# EAGLE design TSOC_ESP32S (EAGLE 6.6.0)
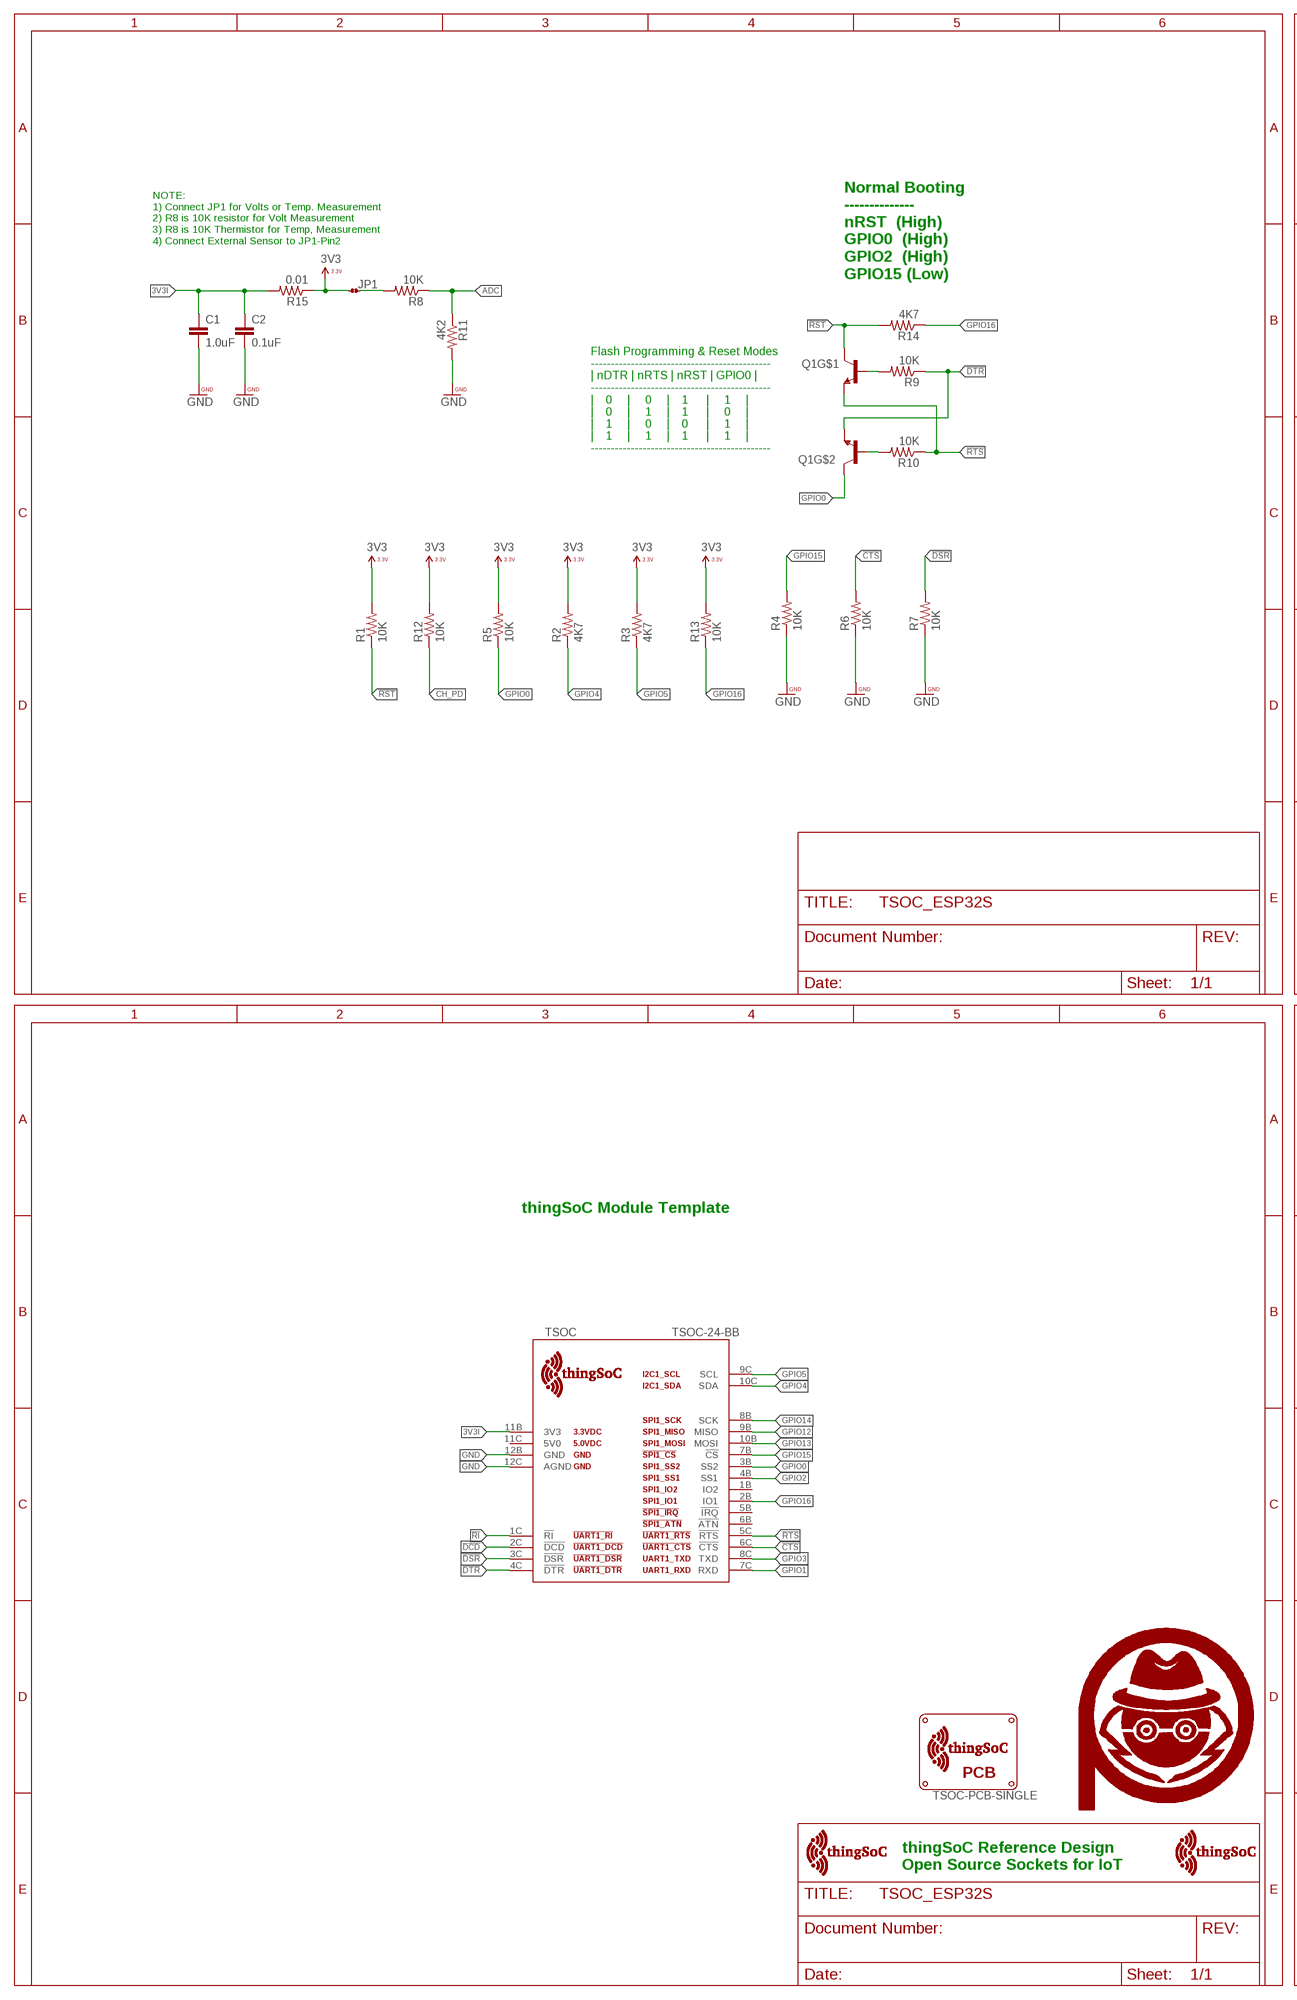
[diagram p0: schematic, sheet 1, part 1 of 2]
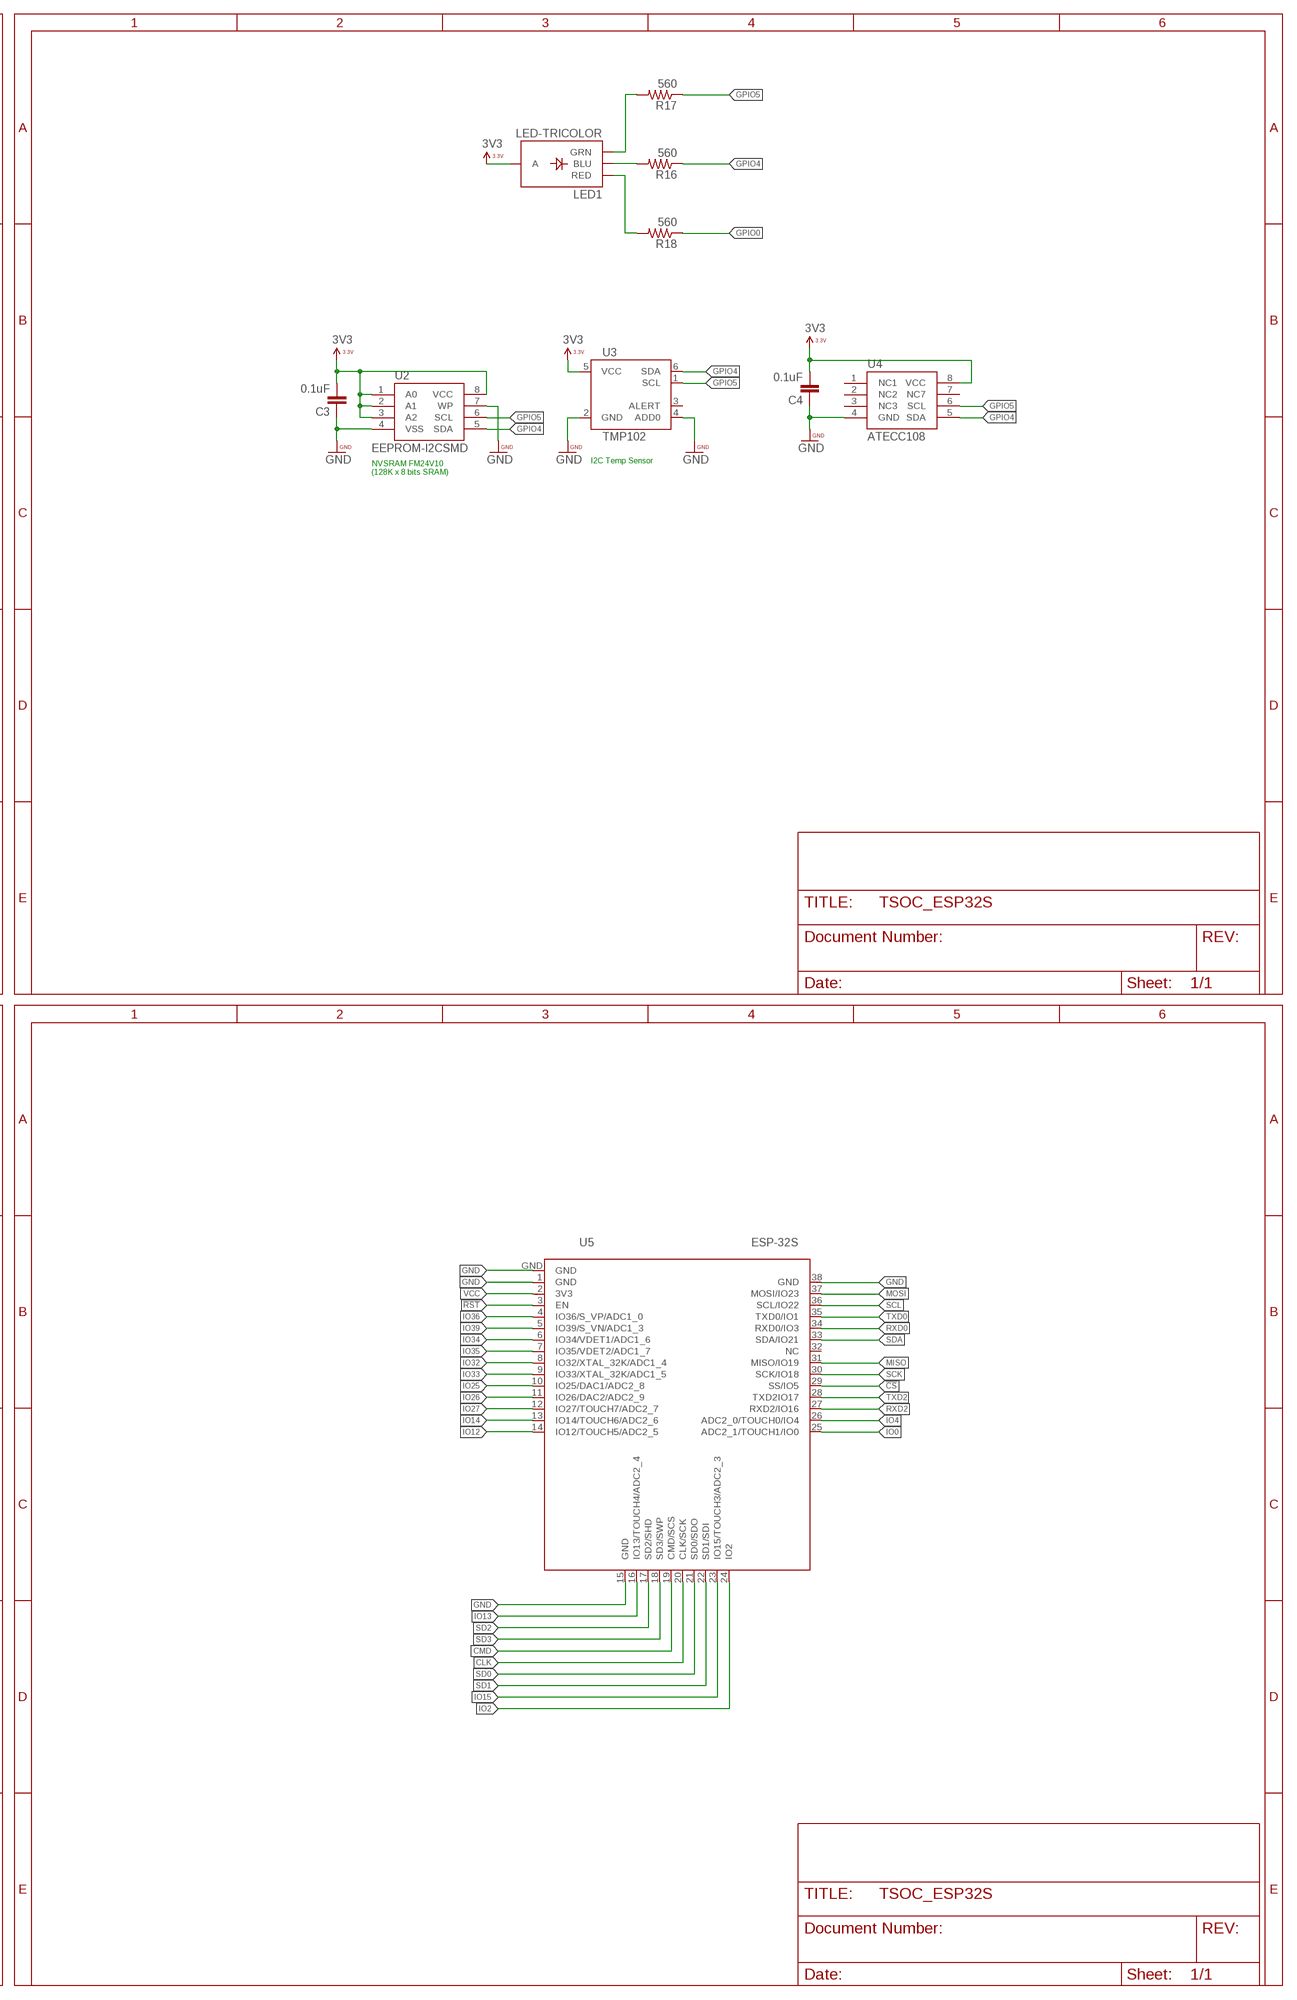
[diagram p1: schematic, sheet 1, part 2 of 2]

## Parts
C1  1.0uF  CAP0402-CAP  [0402-CAP]
C2  0.1uF  CAP0402-CAP  [0402-CAP]
C3  0.1uF  CAP0402-CAP  [0402-CAP]
C4  0.1uF  CAP0402-CAP  [0402-CAP]
JP1  JMP-2-NO-0402  [JMP-2-NO-0402]
LED1  LED-TRICOLOR  [LED-TRICOLOR-SMD]
Q1  MMBT2222A  MMDT3904  [SOT363]
R1  10K  RESISTOR0402  [0402-RES]
R2  4K7  RESISTOR0402  [0402-RES]
R3  4K7  RESISTOR0402  [0402-RES]
R4  10K  RESISTOR0402  [0402-RES]
R5  10K  RESISTOR0402  [0402-RES]
R6  10K  RESISTOR0402  [0402-RES]
R7  10K  RESISTOR0402  [0402-RES]
R8  10K  RESISTOR0402  [0402-RES]
R9  10K  RESISTOR0402  [0402-RES]
R10  10K  RESISTOR0402  [0402-RES]
R11  4K2  RESISTOR0402  [0402-RES]
R12  10K  RESISTOR0402  [0402-RES]
R13  10K  RESISTOR0402  [0402-RES]
R14  4K7  RESISTOR0402  [0402-RES]
R15  0.01  RESISTOR0402  [0402-RES]
R16  560  RESISTOR0402  [0402-RES]
R17  560  RESISTOR0402  [0402-RES]
R18  560  RESISTOR0402  [0402-RES]
TSOC  TSOC-24-BB  [TSOC-BB-S24]
U2  EEPROM-I2CSMD  [SO08]
U3  TMP102  [SOT563]
U4  ATECC108  [SOIC8]
U5  ESP-32S  [ESP-32S]
U$11  PA_LOGO_SYMMED  [PA_LOGO_AGENT_MED_SYM]
U$19  TSOC-LOGO-MED  [TSOC-LOGO-MED]
U$20  TSOC-LOGO-MED  [TSOC-LOGO-MED]
U$25  TSOC-PCB-SINGLE  [TSOC-BB-BRD-DIM]

## Nets
3V3: C3.2 C4.2 JP1.1 LED1.A R1.2 R2.2 R3.2 R5.2 R12.2 R13.2 R15.1 U2.1(A0) U2.2(A1) U2.3(A2) U2.8(VCC) U3.5(VCC) U4.8(VCC)
3V3I: C1.1 C2.1 R15.2 TSOC.11B(3V3)
!CS: U5.29(SS/IO5)
!CTS: R6.2 TSOC.6C(!CTS)
!DCD: TSOC.2C(!DCD)
!DSR: R7.2 TSOC.3C(!DSR)
!DTR: Q1.1(E) R9.1 TSOC.4C(!DTR)
!RI: TSOC.1C(!RI)
!RST: Q1.3(C) R1.1 R14.2 U5.3(EN)
!RTS: Q1.4(E) R10.1 TSOC.5C(!RTS)
ADC: R8.1 R11.1
ADC_RAW: JP1.2 R8.2
BLU: LED1.B(BLU) R16.2
CH_PD: R12.1
CLK: U5.20(CLK/SCK)
CMD: U5.19(CMD/SCS)
GND: C1.2 C2.2 C3.1 C4.1 R4.1 R6.1 R7.1 R11.2 TSOC.12B(GND) TSOC.12C(AGND) U2.4(VSS) U2.7(WP) U3.2(GND) U3.4(ADD0) U4.4(GND) U5.1(GND) U5.15(GND) U5.38(GND) U5.GND
GPIO0: Q1.6(C) R5.1 R18.1 TSOC.3B(SS2)
GPIO1: TSOC.7C(RXD)
GPIO2: TSOC.4B(SS1)
GPIO3: TSOC.8C(TXD)
GPIO4: R2.1 R16.1 TSOC.10C(SDA) U2.5(SDA) U3.6(SDA) U4.5(SDA)
GPIO5: R3.1 R17.1 TSOC.9C(SCL) U2.6(SCL) U3.1(SCL) U4.6(SCL)
GPIO12: TSOC.9B(MISO)
GPIO13: TSOC.10B(MOSI)
GPIO14: TSOC.8B(SCK)
GPIO15: R4.2 TSOC.7B(!CS)
GPIO16: R13.1 R14.1 TSOC.2B(IO1)
GRN: LED1.G(GRN) R17.2
IO0: U5.25(ADC2_1/TOUCH1/IO0)
IO2: U5.24(IO2)
IO4: U5.26(ADC2_0/TOUCH0/IO4)
IO12: U5.14(IO12/TOUCH5/ADC2_5)
IO13: U5.16(IO13/TOUCH4/ADC2_4)
IO14: U5.13(IO14/TOUCH6/ADC2_6)
IO15: U5.23(IO15/TOUCH3/ADC2_3)
IO25: U5.10(IO25/DAC1/ADC2_8)
IO26: U5.11(IO26/DAC2/ADC2_9)
IO27: U5.12(IO27/TOUCH7/ADC2_7)
IO32: U5.8(IO32/XTAL_32K/ADC1_4)
IO33: U5.9(IO33/XTAL_32K/ADC1_5)
IO34: U5.6(IO34/VDET1/ADC1_6)
IO35: U5.7(IO35/VDET2/ADC1_7)
IO36: U5.4(IO36/S_VP/ADC1_0)
IO39: U5.5(IO39/S_VN/ADC1_3)
MISO: U5.31(MISO/IO19)
MOSI: U5.37(MOSI/IO23)
N$6: Q1.5(B) R9.2
N$12: Q1.2(B) R10.2
RED: LED1.R(RED) R18.2
RXD0: U5.34(RXD0/IO3)
RXD2: U5.27(RXD2/IO16)
SCK: U5.30(SCK/IO18)
SCL: U5.36(SCL/IO22)
SD0: U5.21(SD0/SDO)
SD1: U5.22(SD1/SDI)
SD2: U5.17(SD2/SHD)
SD3: U5.18(SD3/SWP)
SDA: U5.33(SDA/IO21)
TXD0: U5.35(TXD0/IO1)
TXD2: U5.28(TXD2IO17)
VCC: U5.2(3V3)
Unconnected: TSOC.1B(IO2) TSOC.5B(!IRQ) TSOC.6B(!ATN) TSOC.11C(5V0) U3.3(ALERT) U4.1(NC1) U4.2(NC2) U4.3(NC3) U4.7(NC7) U5.32(NC)

## Notes on the sheet
- NOTE:
  1) Connect JP1 for Volts or Temp. Measurement
  2) R8 is 10K resistor for Volt Measurement
  3) R8 is 10K Thermistor for Temp, Measurement
  4) Connect External Sensor to JP1-Pin2
- Normal Booting
  --------------
  nRST  (High)
  GPIO0  (High)
  GPIO2  (High) 
  GPIO15 (Low)
- Flash Programming & Reset Modes
  ---------------------------------------------
  | nDTR | nRTS | nRST | GPIO0 |
  ---------------------------------------------
  |    0     |     0     |    1      |     1     |
  |    0     |     1     |    1      |     0     |
  |    1     |     0     |    0      |     1     |
  |    1     |     1     |    1      |     1     |
  ---------------------------------------------
- I2C Temp Sensor
- NVSRAM FM24V10
  (128K x 8 bits SRAM)
- thingSoC Module Template
- thingSoC Reference Design
  Open Source Sockets for IoT

## Library data of the parts
C1-C4 = PatternAgents-ProtoPads:CAP: Capacitor Standard 0603 ceramic capacitor, and 0.1" leaded capacitor.
JP1 = PatternAgents-ProtoPads:JMP-2-NO: Two Terminal Jumper - Normally Open Positions 1 and 2 are normally NOT connected. PatternAgents ProtoPads Library Schematic and PCB layout libraries for design patterns by PatternAgents. For the CADSoft Eagle CAD program : http://www.cadsoftusa.com/download-eagle/ Source LBR : http://www.patternagents.com Github : https://github.com/PatternAgents License : http://creativecommons.org/licenses/by-sa/4.0/ (Creative Commons 4.0) THIS SOFTWARE IS PROVIDED BY THE CONTRIBUTORS "AS IS" AND WITHOUT ANY EXPRESS OR IMPLIED WARRANTIES, INCLUDING, BUT NOT LIMITED TO, THE IMPLIED WARRANTIES OF MERCHANTABILITY AND FITNESS FOR A PARTICULAR PURPOSE ARE DISCLAIMED. IN NO EVENT SHALL THE COPYRIGHT OWNER OR CONTRIBUTORS BE LIABLE FOR ANY DIRECT, INDIRECT, INCIDENTAL, SPECIAL, EXEMPLARY, OR CONSEQUENTIAL DAMAGES (INCLUDING, BUT NOT LIMITED TO, PROCUREMENT OF SUBSTITUTE GOODS OR SERVICES; LOSS OF USE, DATA, OR PROFITS; OR BUSINESS INTERRUPTION) HOWEVER CAUSED AND ON ANY THEORY OF LIABILITY, WHETHER IN CONTRACT, STRICT LIABILITY, OR TORT (INCLUDING NEGLIGENCE OR OTHERWISE) ARISING IN ANY WAY OUT OF THE USE OF THIS SOFTWARE, EVEN IF ADVISED OF THE POSSIBILITY OF SUCH DAMAGE.; BOM: EXCLUDE
LED1 = SparkFun-LED:LED-TRICOLOR: Tri-Color LED SMD Proven layout and schematic for triple color LED in SMD package - common anode. Spark Fun Electronics SKU : COM-07844
Q1 = SparkFun-DiscreteSemi:MMDT3904: Dual NPN transistor
R1-R18 = PatternAgents-ProtoPads:RESISTOR: Resistor Basic schematic elements and footprints for 0603, 1206, and PTH resistors.
TSOC = thingSoC:TSOC-24: thingSoC Twenty-Four(24) Pin Socket Source LBR : http://www.thingsoc.com Github : https://github.com/thingsoc License : http://creativecommons.org/licenses/by-sa/4.0/ (Creative Commons 4.0) THIS SOFTWARE IS PROVIDED BY THE CONTRIBUTORS "AS IS" AND WITHOUT ANY EXPRESS OR IMPLIED WARRANTIES, INCLUDING, BUT NOT LIMITED TO, THE IMPLIED WARRANTIES OF MERCHANTABILITY AND FITNESS FOR A PARTICULAR PURPOSE ARE DISCLAIMED. IN NO EVENT SHALL THE COPYRIGHT OWNER OR CONTRIBUTORS BE LIABLE FOR ANY DIRECT, INDIRECT, INCIDENTAL, SPECIAL, EXEMPLARY, OR CONSEQUENTIAL DAMAGES (INCLUDING, BUT NOT LIMITED TO, PROCUREMENT OF SUBSTITUTE GOODS OR SERVICES; LOSS OF USE, DATA, OR PROFITS; OR BUSINESS INTERRUPTION) HOWEVER CAUSED AND ON ANY THEORY OF LIABILITY, WHETHER IN CONTRACT, STRICT LIABILITY, OR TORT (INCLUDING NEGLIGENCE OR OTHERWISE) ARISING IN ANY WAY OUT OF THE USE OF THIS SOFTWARE, EVEN IF ADVISED OF THE POSSIBILITY OF SUCH DAMAGE.
U2 = SparkFun-DigitalIC:EEPROM-I2C: I2C EEPROM chips, 24LC256 (and others)
U3 = SparkFun-Sensors:TMP102: I2C degC temp sensor; PROD_ID: IC-09303
U4 = SparkFun-DigitalIC:ATECC108: ATECC108: Provides ECDSA with NIST curves P256, B283, and K283. Also, a RNG, 8.5Kb EEPROM. 2.0V - 5.5V.; PROD_ID: IC-11982
U5 = PatternAgents_RFmodules:ESP-32S
U$11 = PatternAgents-Logos:PA_LOGO_SYM: PatternAgents Logo Symbol Trademark : PatternAgents, LLC Github : https://github.com/PatternAgents/PCB_Libraries License : http://creativecommons.org/licenses/by-sa/3.0/ (Creative Commons 3.0) THIS SOFTWARE IS PROVIDED BY THE CONTRIBUTORS "AS IS" AND WITHOUT ANY EXPRESS OR IMPLIED WARRANTIES, INCLUDING, BUT NOT LIMITED TO, THE IMPLIED WARRANTIES OF MERCHANTABILITY AND FITNESS FOR A PARTICULAR PURPOSE ARE DISCLAIMED. IN NO EVENT SHALL THE COPYRIGHT OWNER OR CONTRIBUTORS BE LIABLE FOR ANY DIRECT, INDIRECT, INCIDENTAL, SPECIAL, EXEMPLARY, OR CONSEQUENTIAL DAMAGES (INCLUDING, BUT NOT LIMITED TO, PROCUREMENT OF SUBSTITUTE GOODS OR SERVICES; LOSS OF USE, DATA, OR PROFITS; OR BUSINESS INTERRUPTION) HOWEVER CAUSED AND ON ANY THEORY OF LIABILITY, WHETHER IN CONTRACT, STRICT LIABILITY, OR TORT (INCLUDING NEGLIGENCE OR OTHERWISE) ARISING IN ANY WAY OUT OF THE USE OF THIS SOFTWARE, EVEN IF ADVISED OF THE POSSIBILITY OF SUCH DAMAGE.
U$19 U$20 = thingSoC:TSOC-LOGO: thingSoC Logo Source LBR : http://www.thingsoc.com Github : https://github.com/thingsoc License : http://creativecommons.org/licenses/by-sa/4.0/ (Creative Commons 4.0) THIS SOFTWARE IS PROVIDED BY THE CONTRIBUTORS "AS IS" AND WITHOUT ANY EXPRESS OR IMPLIED WARRANTIES, INCLUDING, BUT NOT LIMITED TO, THE IMPLIED WARRANTIES OF MERCHANTABILITY AND FITNESS FOR A PARTICULAR PURPOSE ARE DISCLAIMED. IN NO EVENT SHALL THE COPYRIGHT OWNER OR CONTRIBUTORS BE LIABLE FOR ANY DIRECT, INDIRECT, INCIDENTAL, SPECIAL, EXEMPLARY, OR CONSEQUENTIAL DAMAGES (INCLUDING, BUT NOT LIMITED TO, PROCUREMENT OF SUBSTITUTE GOODS OR SERVICES; LOSS OF USE, DATA, OR PROFITS; OR BUSINESS INTERRUPTION) HOWEVER CAUSED AND ON ANY THEORY OF LIABILITY, WHETHER IN CONTRACT, STRICT LIABILITY, OR TORT (INCLUDING NEGLIGENCE OR OTHERWISE) ARISING IN ANY WAY OUT OF THE USE OF THIS SOFTWARE, EVEN IF ADVISED OF THE POSSIBILITY OF SUCH DAMAGE.
U$25 = thingSoC:TSOC-PCB: thingSoC PCB Outlines Boards Outlines for Standard Sizes (in the DImension Layer) (Registration marks in the tDocu layer - make sure to turn on tDocu/bDocu) Source LBR : http://www.thingsoc.com Github : https://github.com/thingsoc License : http://creativecommons.org/licenses/by-sa/4.0/ (Creative Commons 4.0) THIS SOFTWARE IS PROVIDED BY THE CONTRIBUTORS "AS IS" AND WITHOUT ANY EXPRESS OR IMPLIED WARRANTIES, INCLUDING, BUT NOT LIMITED TO, THE IMPLIED WARRANTIES OF MERCHANTABILITY AND FITNESS FOR A PARTICULAR PURPOSE ARE DISCLAIMED. IN NO EVENT SHALL THE COPYRIGHT OWNER OR CONTRIBUTORS BE LIABLE FOR ANY DIRECT, INDIRECT, INCIDENTAL, SPECIAL, EXEMPLARY, OR CONSEQUENTIAL DAMAGES (INCLUDING, BUT NOT LIMITED TO, PROCUREMENT OF SUBSTITUTE GOODS OR SERVICES; LOSS OF USE, DATA, OR PROFITS; OR BUSINESS INTERRUPTION) HOWEVER CAUSED AND ON ANY THEORY OF LIABILITY, WHETHER IN CONTRACT, STRICT LIABILITY, OR TORT (INCLUDING NEGLIGENCE OR OTHERWISE) ARISING IN ANY WAY OUT OF THE USE OF THIS SOFTWARE, EVEN IF ADVISED OF THE POSSIBILITY OF SUCH DAMAGE.

## Board
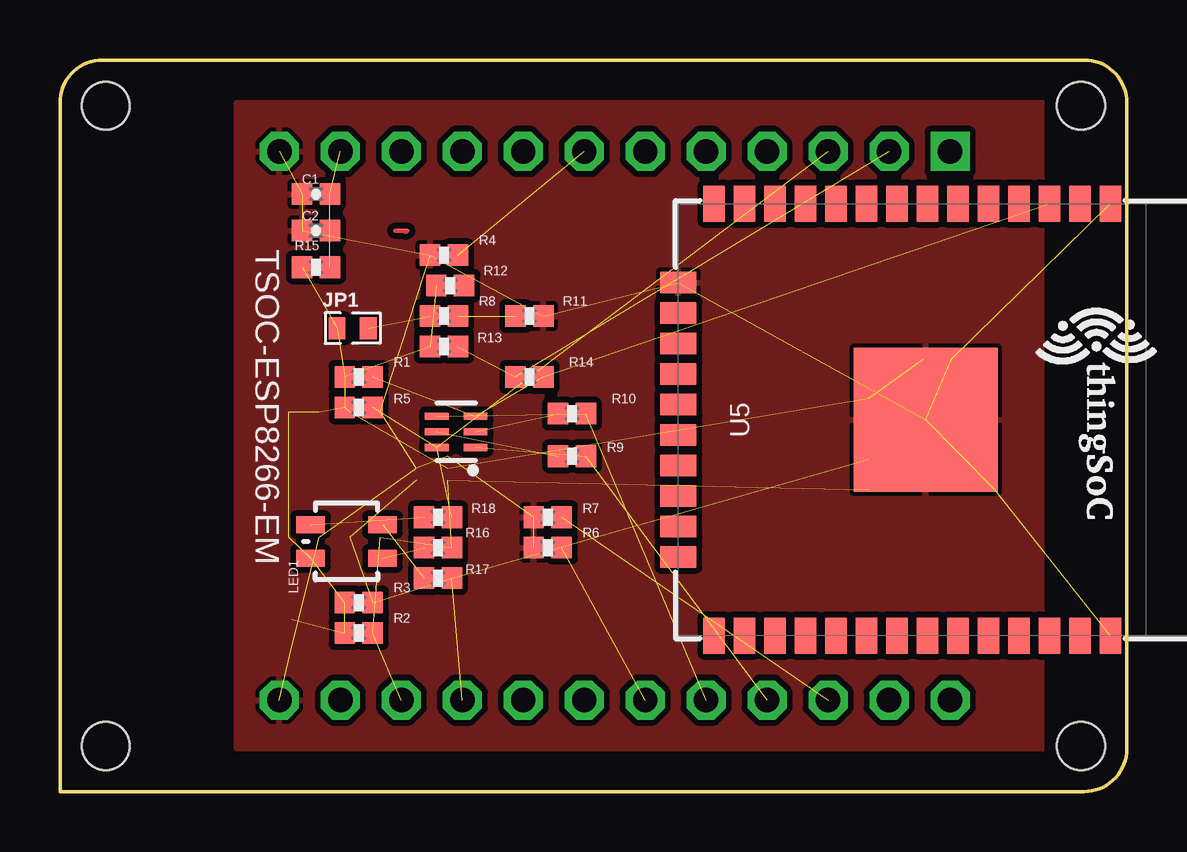
[diagram p2: board, top side]
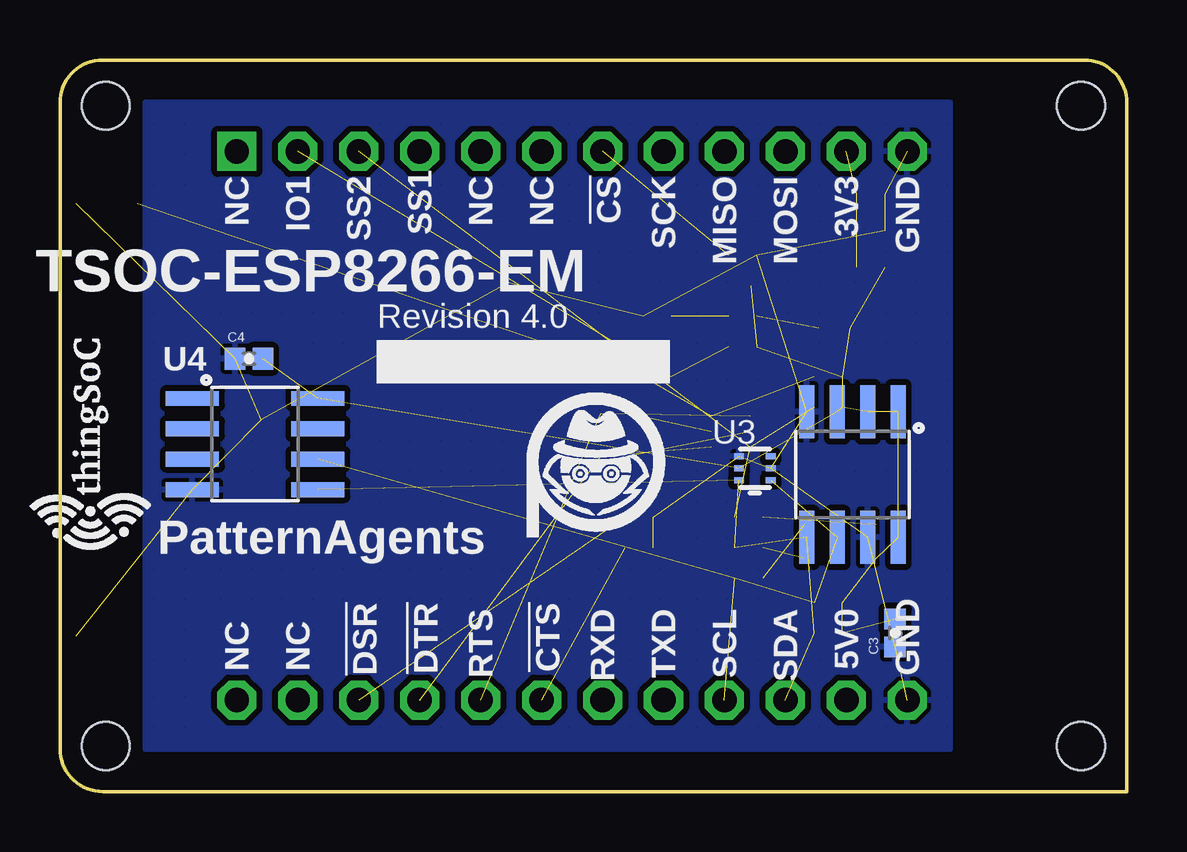
[diagram p3: board, bottom side, seen from below]

Size 44.45 x 30.48 mm. Coordinates in mm from the lower left corner, seen from the top.
Copper layers (1*16): Top 0.035mm / dielectric 1.5mm / Bottom 0.035mm
Design rules "PatternAgents_7mil": minimum track width 7mil, minimum drill 14mil, track to track 7mil, track to pad 7mil, pad to pad 7mil, via to via 7mil, smd to smd 7mil, copper to edge 7mil, drill to drill 7mil, minimum pad ring 12mil, minimum via ring 10mil, stop-mask expansion 4mil, vias tented up to drill 25mil, thermal gap 7mil

### Footprints (pad centres in the part's own frame; a part is rotated, then mirrored left to right if it is on the bottom)
0402-CAP = smd 0.85 x 0.9: 1 -0.58,0; 2 0.58,0
JMP-2-NO-0402 = smd 0.7 x 0.9: 1 -0.65,0; 2 0.65,0
LED-TRICOLOR-SMD = smd 0.7 x 1.2: A 0.7,-1.5; B 0.7,1.5; G -0.7,1.5; R -0.7,-1.5
SOT363 = smd 0.3 x 0.99: 1 -0.65,-0.8; 2 0,-0.8; 3 0.65,-0.8; 4 0.65,0.81; 5 0,0.81; 6 -0.65,0.81
0402-RES = smd 0.85 x 0.9: 1 -0.58,0; 2 0.58,0
TSOC-BB-S24 = drill 1.016 square: 1B -11.43,11.43 | drill 1.016 octagon: 1C 11.43,11.43; 2B -11.43,8.89; 2C 11.43,8.89; 3B -11.43,6.35; 3C 11.43,6.35; 4B -11.43,3.81; 4C 11.43,3.81; 5B -11.43,1.27; 5C 11.43,1.27; 6B -11.43,-1.27; 6C 11.43,-1.27; 7B -11.43,-3.81; 7C 11.43,-3.81; 8B -11.43,-6.35; 8C 11.43,-6.35; 9B -11.43,-8.89; 9C 11.43,-8.89; 10B -11.43,-11.43; 10C 11.43,-11.43; 11B -11.43,-13.97; 11C 11.43,-13.97; 12B -11.43,-16.51; 12C 11.43,-16.51
SO08 = smd 0.61 x 2.21: 1 -1.905,-2.616; 2 -0.635,-2.616; 3 0.635,-2.616; 4 1.905,-2.616; 5 1.905,2.616; 6 0.635,2.616; 7 -0.635,2.616; 8 -1.905,2.616
SOT563 = smd 0.25 x 0.4: 1 -0.5,-0.66; 2 0,-0.66; 3 0.5,-0.66; 4 0.5,0.66; 5 0,0.66; 6 -0.5,0.67
SOIC8 = smd 0.61 x 2.21: 1 -1.905,-2.616; 2 -0.635,-2.616; 3 0.635,-2.616; 4 1.905,-2.616; 5 1.905,2.616; 6 0.635,2.616; 7 -0.635,2.616; 8 -1.905,2.616
ESP-32S = smd 0.9 x 1.5: 1 7.7,9; 2 6.43,9; 3 5.16,9; 4 3.89,9; 5 2.62,9; 6 1.35,9; 7 0.08,9; 8 -1.19,9; 9 -2.46,9; 10 -3.73,9; 11 -5,9; 12 -6.27,9; 13 -7.54,9; 14 -8.81,9; 25 -8.81,-9; 26 -7.54,-9; 27 -6.27,-9; 28 -5,-9; 29 -3.73,-9; 30 -2.46,-9; 31 -1.19,-9; 32 0.08,-9; 33 1.35,-9; 34 2.62,-9; 35 3.89,-9; 36 5.16,-9; 37 6.43,-9; 38 7.7,-9 | smd 1.5 x 0.9: 15 -10.3,5.715; 16 -10.3,4.445; 17 -10.3,3.175; 18 -10.3,1.905; 19 -10.3,0.635; 20 -10.3,-0.635; 21 -10.3,-1.905; 22 -10.3,-3.175; 23 -10.3,-4.445; 24 -10.3,-5.715 | smd 6 x 6: GND 0,0
TSOC-BB-BRD-DIM = hole 2: 13.335,16.891; -13.335,16.891; 13.335,-23.749; -13.335,-23.749

### Placement (x,y rotation side)
C1  10.67,24.89 180 top
C2  10.67,23.37 180 top
C3  9.65,6.6 90 bottom
C4  36.58,18.03 0 bottom
JP1  12.19,19.3 0 top
LED1  11.94,10.41 270 top
Q1  16.51,14.99 90 top
R1  12.45,17.27 180 top
R2  12.45,6.6 180 top
R3  12.45,7.87 180 top
R4  16,22.35 0 top
R5  12.45,16 180 top
R6  20.32,10.16 0 top
R7  20.32,11.43 0 top
R8  16,19.81 180 top
R9  21.34,13.97 180 top
R10  21.34,15.75 180 top
R11  19.56,19.81 0 top
R12  16.26,21.08 180 top
R13  16,18.54 180 top
R14  19.56,17.27 0 top
R15  10.67,21.84 0 top
R16  15.75,10.16 180 top
R17  15.75,8.89 180 top
R18  15.75,11.43 180 top
TSOC  25.65,15.24 270 top
U2  11.43,13.21 180 bottom
U3  15.49,13.46 90 bottom
U4  36.32,14.48 270 bottom
U5  36.07,15.49 0 top
U$11  22.1,13.21 0 bottom
U$19  43.18,11.68 90 bottom
U$20  43.18,18.54 270 top
U$25  25.65,15.24 270 top

### Tracks (layer width: path | path; a pad name or v marks a point on that pad's centre or on a via)
3V3  (16 unrouted)
3V3I  (3 unrouted)
!CTS  (1 unrouted)
!DSR  (1 unrouted)
!DTR  (2 unrouted)
!RST  (3 unrouted)
!RTS  (2 unrouted)
ADC  (1 unrouted)
ADC_RAW  (1 unrouted)
BLU  (1 unrouted)
GND  (18 unrouted)
  pour Bottom (isolate 0.254, hatched): 7.37,1.78 7.37,28.7 40.89,28.7 40.89,1.78
  pour Top (isolate 0.254, hatched): 7.37,1.78 7.37,28.7 40.89,28.7 40.89,1.78
GPIO0  (3 unrouted)
GPIO4  (5 unrouted)
GPIO5  (5 unrouted)
GPIO15  (1 unrouted)
GPIO16  (2 unrouted)
GRN  (1 unrouted)
N$1
  Top 0.178: 14.39,23.32 14.48,23.37 13.97,23.37 13.97,23.36
N$6  (1 unrouted)
N$12  (1 unrouted)
RED  (1 unrouted)

### Text on the board
tPlace: TSOC-ESP8266-EM
bPlace: GND | 3V3 | MOSI | MISO | SCK | !CS | NC | NC | SS1 | SS2 | IO1 | NC | TSOC-ESP8266-EM | Revision 4.0 | U3 | PatternAgents | 5V0 | SDA | SCL | TXD | RXD | !CTS | RTS | !DTR | !DSR | NC | NC | GND